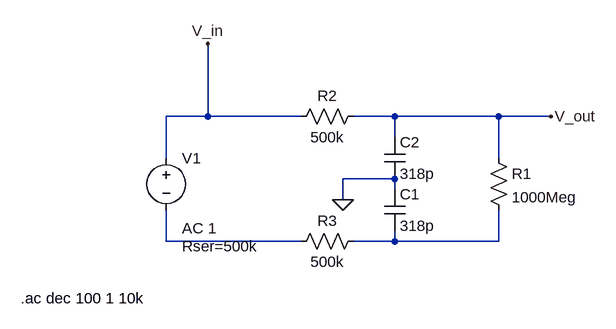
[diagram p0: schematic Filter_RC_Optimal.asc]
Filter_RC_Optimal.asc, the LTspice schematic file:
Version 4
SHEET 1 880 680
WIRE -256 32 -256 -80
WIRE -256 32 -320 32
WIRE -112 32 -256 32
WIRE 32 32 -32 32
WIRE 192 32 32 32
WIRE 272 32 192 32
WIRE 32 64 32 32
WIRE -320 96 -320 32
WIRE 192 96 192 32
WIRE 32 128 -48 128
WIRE 32 144 32 128
WIRE -48 160 -48 128
WIRE -320 224 -320 176
WIRE -112 224 -320 224
WIRE 32 224 32 208
WIRE 32 224 -32 224
WIRE 192 224 192 176
WIRE 192 224 32 224
FLAG -48 160 0
FLAG 272 32 V_out
FLAG -256 -80 V_in
SYMBOL cap 16 144 R0
SYMATTR InstName C1
SYMATTR Value 318p
SYMBOL res 176 80 R0
SYMATTR InstName R1
SYMATTR Value 1000Meg
SYMBOL voltage -320 80 R0
WINDOW 123 24 124 Left 2
WINDOW 39 24 152 Left 2
SYMATTR Value2 AC 1
SYMATTR SpiceLine Rser=500k
SYMATTR InstName V1
SYMATTR Value ""
SYMBOL res -16 16 R90
WINDOW 0 0 56 VBottom 2
WINDOW 3 32 56 VTop 2
SYMATTR InstName R2
SYMATTR Value 500k
SYMBOL res -16 208 R90
WINDOW 0 0 56 VBottom 2
WINDOW 3 32 56 VTop 2
SYMATTR InstName R3
SYMATTR Value 500k
SYMBOL cap 16 64 R0
SYMATTR InstName C2
SYMATTR Value 318p
TEXT -544 312 Left 2 !.ac dec 100 1 10k

The netlist it stands for:
* Filter_RC_Optimal.asc
C1 0 N002 318p
R1 V_out N002 1000Meg
V1 V_in N001 AC 1 Rser=500k
R2 V_out V_in 500k
R3 N002 N001 500k
C2 V_out 0 318p
.ac dec 100 1 10k
.backanno
.end

* Results of the author's LTspice run, read from the files saved beside the schematic
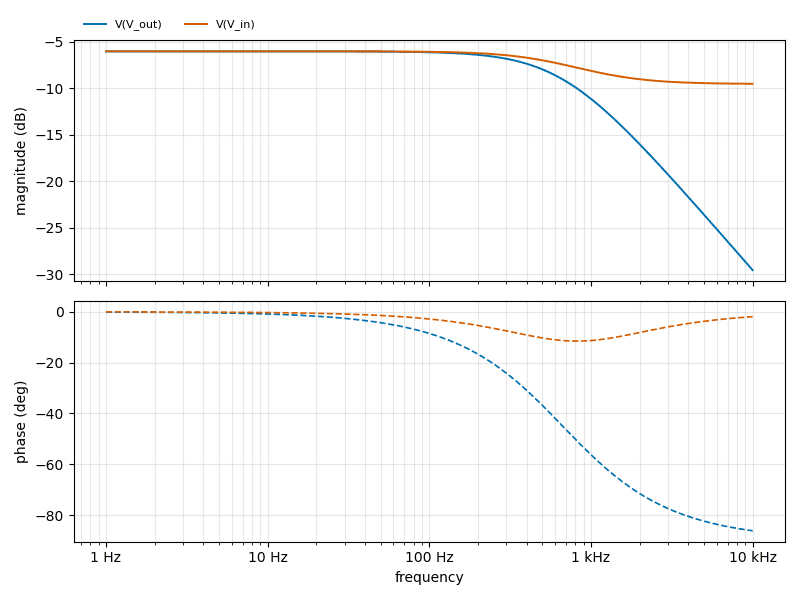
[diagram p1: AC Analysis of Filter_RC_Optimal.asc, plotted from the saved traces]
* AC Analysis, 1 run:
*   V(V_out): -6.03 dB at 1 Hz, -29.55 dB at 10 kHz, peak -6.03 dB at 1 Hz, 3 dB below the peak at 668.3 Hz
*   V(V_in): -6.02 dB at 1 Hz, -9.52 dB at 10 kHz, peak -6.02 dB at 1 Hz, 3 dB below the peak at 2.013 kHz